# Altium schematic sheet CH3-Isolation.SchDoc: CH3 ISOLATION
size A4; Author: MOG; CompanyName: GIE GROUP; DrawnBy: MOG; Organization: Gie SA; Address1: Galicia 52; Address2: Mar del Plata; Address3: Buenos Aires; Address4: Argentina; DocumentNumber: 7; Revision: 0.0; SheetNumber: 8; SheetTotal: 14; Project: CP DATALOGGER; PageSetup: Record=PageOptions|CenterHorizontal=True|CenterVertical=True|PrintScale=0.94|XCorrection=1.00|YCorrection=1.00|PrintKind=0|BorderSize=5000000|LeftOffset=0|BottomOffset=0|Orientation=2|PaperLength=1000|PaperWidth=1000|Scale=100|PaperSource=7|PrintQuality=720|MediaType=1|DitherType=10|PaperKind=A4|PrintScaleMode=1
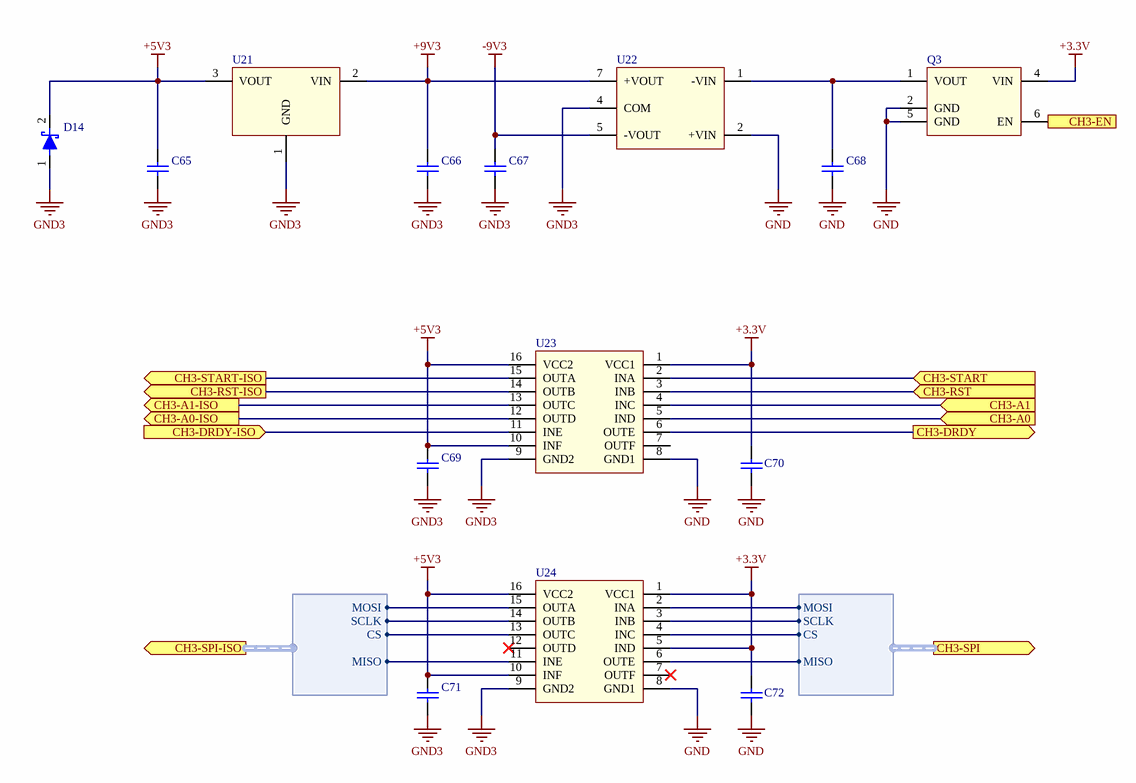
[diagram p0: CH3-Isolation.SchDoc]

## Parts
C65  C0603C105M3RAC7867  [CAP-0603]  (value not drawn)
C66  C0603C105M3RAC7867  [CAP-0603]  (value not drawn)
C67  C0603C105M3RAC7867  [CAP-0603]  (value not drawn)
C68  C0603C105M3RAC7867  [CAP-0603]  (value not drawn)
C69  C0603C105M3RAC7867  [CAP-0603]  (value not drawn)
C70  C0603C105M3RAC7867  [CAP-0603]  (value not drawn)
C71  C0603C105M3RAC7867  [CAP-0603]  (value not drawn)
C72  C0603C105M3RAC7867  [CAP-0603]  (value not drawn)
D14  (no value)  [SOD323 - DIODE UNIDIR]
Q3  (no value)  [TSSOP6]
U21  (no value)  [SOT23-5]
U22  R1D-3.309/P  [RECOM-R1D]  (value not drawn)
U23  (no value)  [SSOP16]
U24  (no value)  [SSOP16]

## Ports
CH3-A0 (in), CH3-A0-ISO (out), CH3-A1 (in), CH3-A1-ISO (out), CH3-DRDY (out), CH3-DRDY-ISO (in), CH3-EN (in), CH3-RST (in), CH3-RST-ISO (out), CH3-SPI (out, harness CH3-SPI), CH3-SPI-ISO (out, harness CH3-SPI-ISO), CH3-START (in), CH3-START-ISO (out)

## Harnesses
CH3-SPI-ISO: MOSI, MISO, SCLK, CS
CH3-SPI: MOSI, MISO, SCLK, CS

## Nets
+3.3V: C70.2 C72.2 Q3.4(VIN) U23.1(VCC1) U24.1(VCC1) U24.5(IND)
+5V3: C65.2 C69.2 C71.2 D14.2(K) U21.3(VOUT) U23.10(INF) U23.16(VCC2) U24.10(INF) U24.16(VCC2)
+9V3: C66.2 U21.2(VIN) U22.7(+VOUT)
-9V3: C67.2 U22.5(-VOUT)
GND: C68.1 C70.1 C72.1 Q3.2(GND) Q3.5(GND) U22.2(+VIN) U23.8(GND1) U24.8(GND1)
GND3: C65.1 C66.1 C67.1 C69.1 C71.1 D14.1(A) U21.1(GND) U22.4(COM) U23.9(GND2) U24.9(GND2)
CH3-A0: U23.5(IND) ; port CH3-A0
CH3-A0-ISO: U23.12(OUTD) ; port CH3-A0-ISO
CH3-A1: U23.4(INC) ; port CH3-A1
CH3-A1-ISO: U23.13(OUTC) ; port CH3-A1-ISO
CH3-DRDY: U23.6(OUTE) ; port CH3-DRDY
CH3-DRDY-ISO: U23.11(INE) ; port CH3-DRDY-ISO
CH3-EN: Q3.6(EN) ; port CH3-EN
CH3-RST: U23.3(INB) ; port CH3-RST
CH3-RST-ISO: U23.14(OUTB) ; port CH3-RST-ISO
CH3-START: U23.2(INA) ; port CH3-START
CH3-START-ISO: U23.15(OUTA) ; port CH3-START-ISO
NetC68_2: C68.2 Q3.1(VOUT) U22.1(-VIN)
NetU24_2: U24.2(INA) ; port CH3-SPI.MOSI
NetU24_3: U24.3(INB) ; port CH3-SPI.SCLK
NetU24_4: U24.4(INC) ; port CH3-SPI.CS
NetU24_6: U24.6(OUTE) ; port CH3-SPI.MISO
NetU24_11: U24.11(INE) ; port CH3-SPI-ISO.MISO
NetU24_13: U24.13(OUTC) ; port CH3-SPI-ISO.CS
NetU24_14: U24.14(OUTB) ; port CH3-SPI-ISO.SCLK
NetU24_15: U24.15(OUTA) ; port CH3-SPI-ISO.MOSI

Not connected (* = marked no-connect by the designer): U23 7(OUTF); U24 7(OUTF)* 12(OUTD)*

## Notes on the sheet
- PROYECTO:
- Rev:
- NOMBRE:
- FECHA:
- REALIZO:
- REVISO:
- APROBO:
- PAG:
- HOJA:
- DE
- A4

## Library data of the parts
C65-C72 = C0603C105M3RAC7867: CAP CER 1uF 25V X7R 0603; Manufacturer: Kemet; Tolerance: 20%; Voltage: 25; PartNumber: C0603C105M3RAC7867; Supplier 1: Digi-Key; Supplier 2: Mouser; Supplier Part Number 1: 399-C0603C105M3RAC7867CT-ND; Supplier Part Number 2: 80-C0603C105M3R
D14 = MM3Z5V6T1G: Schottky Diode 30V 200mA SOT323; Manufacturer: OnSemiconductor
Q3 = MIC94092YC6-TR: Manufacturer: Microchip
U21 = NCP716BCSN500T1G: IC REG LDO 0.5V 0.15A TSOT23-5; Manufacturer: ON Semiconductor
U22 = R1D-3.309/P: DC DC CONVERTER +/-9V 1W; Manufacturer: Recom; Supplier 1: Digi-Key; Supplier 2: Mouser; Supplier Part Number 1: R1D-3.309/P-ND; Supplier Part Number 2: 919-R1D-3.309P
U23 U24 = ISO7762FDBQ: Digital Isolator, six-channel, 4/2, 16-SSOP; Manufacturer: Texas Instruments; Supplier 1: Digi-Key; Supplier 2: Mouser; Supplier Part Number 1: 296-49452-6-ND; Supplier Part Number 2: 595-ISO7762FDBQR